# Altium schematic sheet Microproject_25.SchDoc
size A4
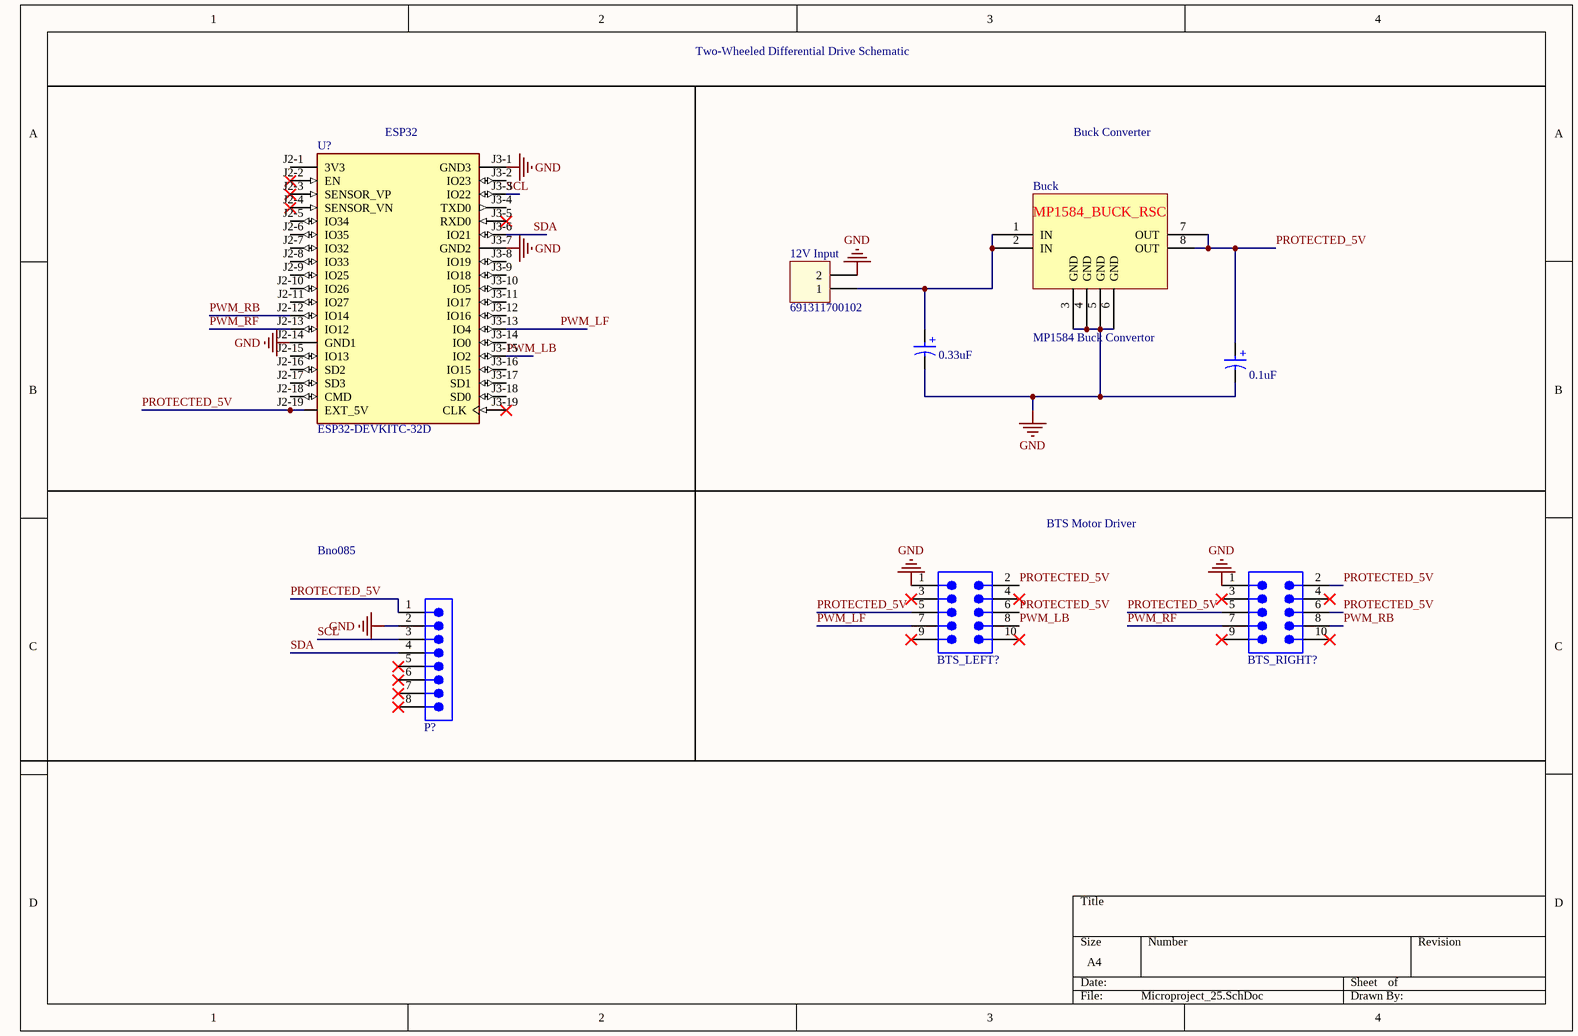
[diagram p0: Microproject_25.SchDoc]

## Parts
0.1uF  22uF  [WCAP-ATG8_D5H11]  (value not drawn)
0.33uF  22uF  [WCAP-ATG8_D5H11]  (value not drawn)
12V_Input  691311700102  [691311700102]
BTS_LEFT?  612010235121  [612010235121]  (value not drawn)
BTS_RIGHT?  612010235121  [612010235121]  (value not drawn)
Buck  MP1584 Buck Convertor  [MP1584]
P?  68800811622  [68800811622]  (value not drawn)
U?  ESP32-DEVKITC-32D  [MODULE_ESP32-DEVKITC-32D]

## Nets
GND: 0.1uF.2(N) 0.33uF.2(N) 12V_Input.2 BTS_LEFT?.1 BTS_RIGHT?.1 Buck.3(GND) Buck.4(GND) Buck.5(GND) Buck.6(GND) P?.2 U?.J2-14(GND1) U?.J3-1(GND3) U?.J3-7(GND2)
PROTECTED_5V: 0.1uF.1(P) BTS_LEFT?.2 BTS_LEFT?.5 BTS_LEFT?.6 BTS_RIGHT?.2 BTS_RIGHT?.5 BTS_RIGHT?.6 Buck.7(OUT) Buck.8(OUT) P?.1 U?.J2-19(EXT_5V)
PWM_LB: BTS_LEFT?.8 U?.J3-15(IO2)
PWM_LF: BTS_LEFT?.7 U?.J3-13(IO4)
PWM_RB: BTS_RIGHT?.8 U?.J2-12(IO14)
PWM_RF: BTS_RIGHT?.7 U?.J2-13(IO12)
SCL: P?.3 U?.J3-3(IO22)
SDA: P?.4 U?.J3-6(IO21)
Net0.33uF_1: 0.33uF.1(P) 12V_Input.1 Buck.1(IN) Buck.2(IN)

Not connected (* = marked no-connect by the designer): BTS_LEFT? 3* 4* 9* 10*; BTS_RIGHT? 3* 4* 9* 10*; P? 5* 6* 7* 8*; U? J2-1(3V3) J2-2(EN)* J2-3(SENSOR_VP)* J2-4(SENSOR_VN)* J2-5(IO34) J2-6(IO35) J2-7(IO32) J2-8(IO33) J2-9(IO25) J2-10(IO26) J2-11(IO27) J2-15(IO13) J2-16(SD2) J2-17(SD3) J2-18(CMD) J3-2(IO23) J3-4(TXD0) J3-5(RXD0)* J3-8(IO19) J3-9(IO18) J3-10(IO5) J3-11(IO17) J3-12(IO16) J3-14(IO0) J3-16(IO15) J3-17(SD1) J3-18(SD0) J3-19(CLK)*

## Notes on the sheet
- Two-Wheeled Differential Drive Schematic
- (near U?) ESP32
- Buck Converter
- Bno085
- BTS Motor Driver
- (in symbol 860010272001) +
- (in symbol MP1584 Buck Convertor) MP1584_BUCK_RSC

## Library data of the parts
0.1uF 0.33uF = 860010272001: WCAP-ATG8 Aluminum Electrolytic Capacitor, Radial, THT, D5 x H11mm, 22uF, 10V; Manufacturer: Wurth Elektronik; Capacitance Tolerance: +/-20%; Dissipation Factor: 19%; Endurance: 2000h; Leakage Current: 3uA; Ripple Current: 66mA; Technical Reference: ATBC110220M010DSPA3B000; Manufacturer Part Number: 860010272001; Category: Aluminum Electrolytic Capacitors; Match Code: WCAP-ATG8; ComponentLink1Description: Website Link; ComponentLink1URL: https://www.we-online.com/redexpert/article/860010272001?ad; ComponentLink2Description: Datasheet Link; ComponentLink2URL: https://www.we-online.com/redexpert/spec/860010272001?ad; Mount: Through Hole; Operating Temperature Max: 85°C; Operating Temperature Min: -40°C; Packaging: Ammo Pack; Height: 11mm; Diameter: 5mm; Capacitance: 22uF; Rated Voltage (DC): 10V
12V_Input = 691311700102: WR-TBL Serie 3117 - 5.00 mm Close Vertical PCB Header, 02p; Pitch: 5 mm; Published Date: Jan 2017; Publisher: Wurth Elektronik; ComponentLink1Description: Manufacturer; ComponentLink1URL: http://www.we-online.de; ComponentLink2Description: Datasheet; ComponentLink2URL: http://katalog.we-online.de/em/datasheet/6913117001xx.pdf; Part Number: 691311700102; Pin Number: 02p
BTS_LEFT? BTS_RIGHT? = 612010235121: WR-BHD Male Box Header, THT Straight, pitch 2.54mm, 2 row, 10 pin; Manufacturer: Wurth Elektronik; Contact Resistance: 20mOhm; Insulation Resistance: 1000MOhm; Rated Current: 3A; Working Voltage: 250V; Withstanding Voltage: 500V; Manufacturer Part Number: 612010235121; Category: Wire-to-Board Connectors; Match Code: WR-BHD; ComponentLink1Description: Website Link; ComponentLink1URL: https://www.we-online.com/redexpert/article/612010235121?ad; ComponentLink2Description: Datasheet Link; ComponentLink2URL: https://www.we-online.com/redexpert/spec/612010235121?ad; Mount: Through Hole; Operating Temperature Max: 125°C; Operating Temperature Min: -40°C; Packaging: Tray; Length: 20.3mm; Width: 9.05mm; Height: 9.05mm; Gender: Male; Number of Pins: 10; Number of Rows: 2; Orientation: Straight; Pitch: 2.54mm
P? = 68800811622: WR-WTB “J” Type THT Vertical Male Shrouded Header, pitch 2.5mm, 8pins; Manufacturer: Wurth Elektronik; Contact Resistance: 20mOhm; Rated Current: 3A; Working Voltage: 250VAC; Withstanding Voltage: 800VAC; ComponentLink1Description: Website Link; ComponentLink1URL: https://www.we-online.com/redexpert/article/68800811622?ad; ComponentLink2Description: Datasheet Link; ComponentLink2URL: https://www.we-online.com/redexpert/spec/68800811622?ad; Manufacturer Part Number: 68800811622; Category: Wire-to-Board Connectors; Match Code: WR-WTB; Mount: Through Hole; Operating Temperature Max: 85°C; Operating Temperature Min: -25°C; Packaging: Bag; Length: 22.5mm; Width: 3.8mm; Height: 6mm; Gender: Male; Number of Pins: 8; Number of Rows: 1; Orientation: Vertical; Pitch: 2.5mm
U? = ESP32-DEVKITC-32D: WiFi Development Tools (802.11) ESP32 General Development Kit, ESP32-WROOM-32D on the board; MF: Espressif Systems; SnapEDA_Link: https://www.snapeda.com/parts/ESP32-DEVKITC-32D/Espressif+Systems/view-part/?ref=snap; Package: None; Value: *; MP: ESP32-DEVKITC-32D; Check_prices: https://www.snapeda.com/parts/ESP32-DEVKITC-32D/Espressif+Systems/view-part/?ref=eda